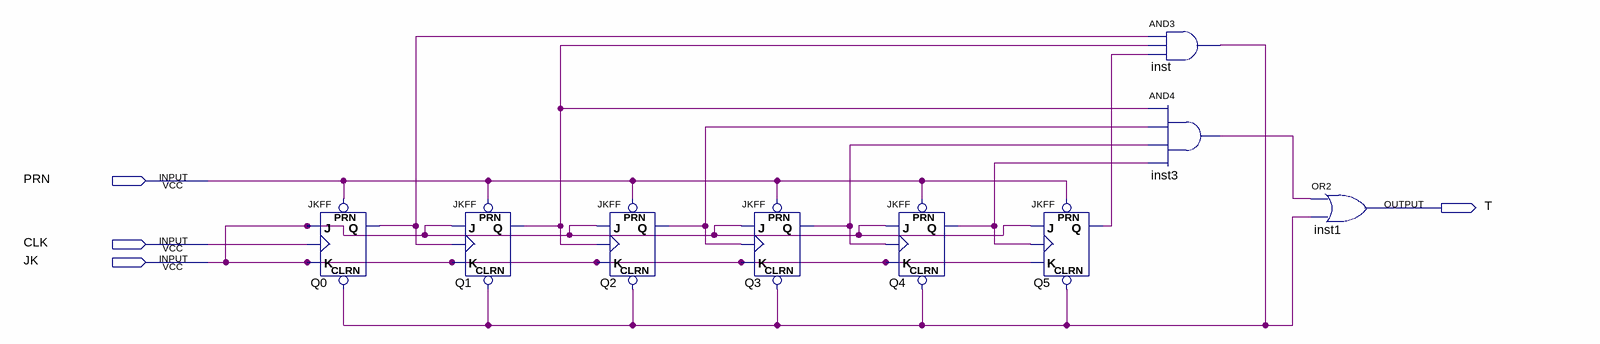
[diagram p0: schematic sheet]
// Quartus schematic Contador.bdf as structural Verilog: 9 symbols, 4 pins
module Contador (
  input  PRN,
  input  CLK,
  input  JK,
  output T
);

  wire inst3_out, inst_out, Q0_q, Q1_q, Q2_q, Q3_q, Q4_q, Q5_q;

  JKFF Q0 (.PRN(PRN), .CLRN(inst_out), .K(JK), .J(JK), .CLK(CLK), .Q(Q0_q));
  JKFF Q1 (.PRN(PRN), .CLRN(inst_out), .K(JK), .J(JK), .CLK(Q0_q), .Q(Q1_q));
  JKFF Q2 (.PRN(PRN), .CLRN(inst_out), .K(JK), .J(JK), .CLK(Q1_q), .Q(Q2_q));
  JKFF Q3 (.PRN(PRN), .CLRN(inst_out), .K(JK), .J(JK), .CLK(Q2_q), .Q(Q3_q));
  JKFF Q4 (.PRN(PRN), .CLRN(inst_out), .K(JK), .J(JK), .CLK(Q3_q), .Q(Q4_q));
  JKFF Q5 (.PRN(PRN), .CLRN(inst_out), .K(JK), .J(JK), .CLK(Q4_q), .Q(Q5_q));
  and inst (inst_out, Q0_q, Q1_q, Q5_q);
  and inst3 (inst3_out, Q1_q, Q2_q, Q3_q, Q4_q);
  or inst1 (T, inst3_out, inst_out);
endmodule
